# EAGLE design supply (EAGLE 6.1)
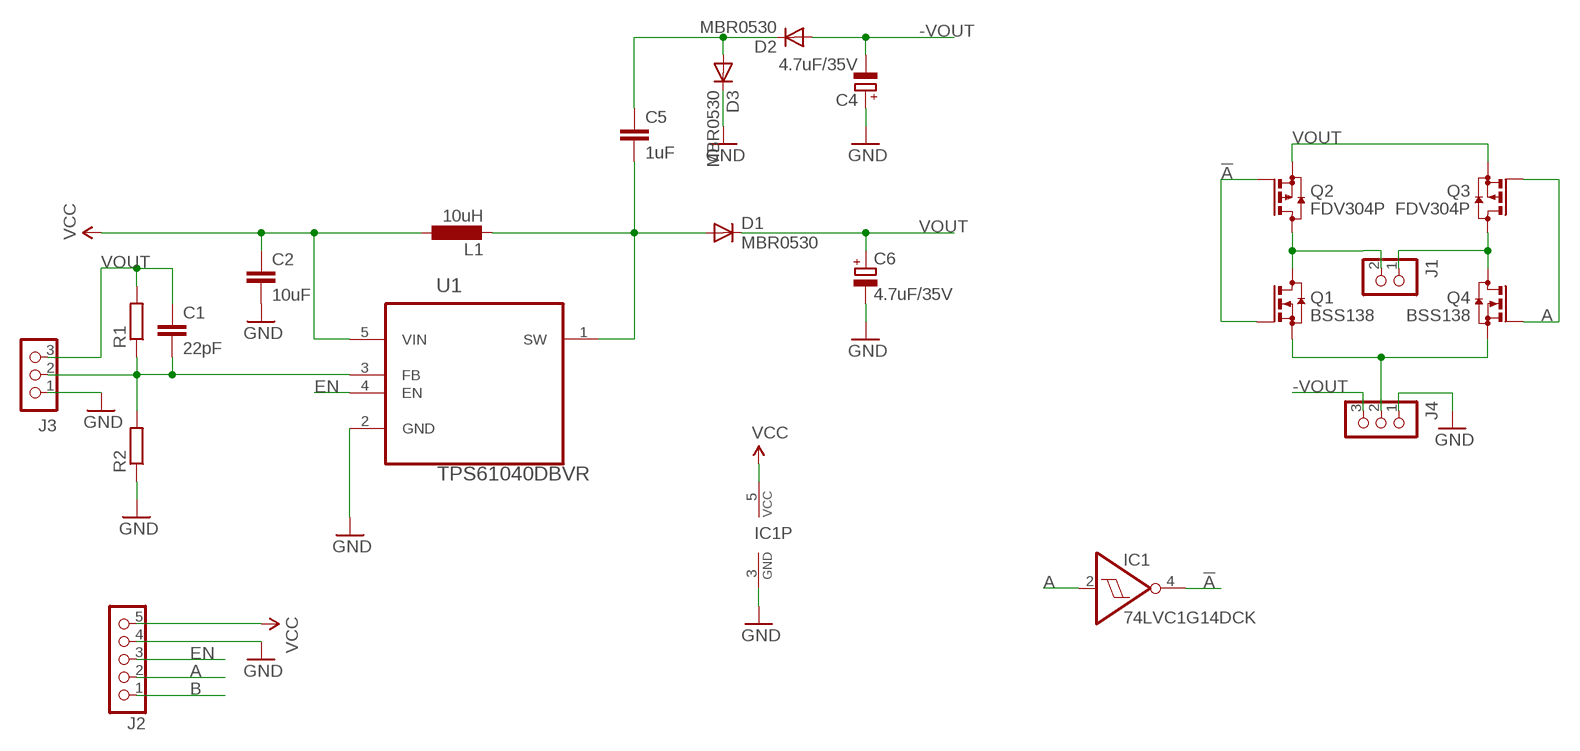
[diagram p0: schematic, sheet 1]

## Parts
C1  22pF  C-EUC0603  [C0603]
C2  10uF  C-EUC0603  [C0603]
C4  4.7uF/35V  CPOL-EU140CLH-1010  [140CLH-1010]
C5  1uF  C-EUC0603  [C0603]
C6  4.7uF/35V  CPOL-EU140CLH-1010  [140CLH-1010]
D1  MBR0530  DIODE-SOD123  [SOD123]
D2  MBR0530  DIODE-SOD123  [SOD123]
D3  MBR0530  DIODE-SOD123  [SOD123]
IC1  74LVC1G14DCK  [SC70-5]
J1  CON_HEADER_1X02-PTH  [M1X2]
J2  CON_HEADER_1X05-PTH  [M1X5]
J3  CON_HEADER_1X03-PTH  [M1X3]
J4  CON_HEADER_1X03-PTH  [M1X3]
L1  10uH  L-EUL2825P  [L2825P]
Q1  BSS138  BSS123  [SOT23]
Q2  FDV304P  BSS84  [SOT23]
Q3  FDV304P  BSS84  [SOT23]
Q4  BSS138  BSS123  [SOT23]
R1  R-EU_R0603  [R0603]
R2  R-EU_R0603  [R0603]
U1  TPS61040DBVR  [SOT95P280X145-5N]

## Nets
!A: IC1.4(O) Q1.1(G) Q2.1(G)
-VOUT: C4.- D2.A J4.3
A: IC1.2(I) J2.2 Q3.1(G) Q4.1(G)
B: J2.1
EN: J2.3 U1.4(EN)
GND: C2.2 C4.+ C6.- D3.C IC1.3(GND) J2.4 J3.1 J4.1 R2.1 U1.2(GND)
N$1: C1.2 J3.2 R1.1 R2.2 U1.3(FB)
N$2: C5.2 D1.A L1.2 U1.1(SW)
N$3: J1.2 Q1.3(D) Q2.3(D)
N$4: J1.1 Q3.3(D) Q4.3(D)
N$5: C5.1 D2.C D3.A
N$6: J4.2 Q1.2(S) Q4.2(S)
VCC: C2.1 IC1.5(VCC) J2.5 L1.1 U1.5(VIN)
VOUT: C1.1 C6.+ D1.C J3.3 Q2.2(S) Q3.2(S) R1.2

## Library data of the parts
C1 C2 C5 = rcl:C-EU: CAPACITOR, European symbol
C4 C6 = rcl:CPOL-EU: POLARIZED CAPACITOR, European symbol
D1-D3 = dan:DIODE-: DIODE
IC1 = 74xx-little-de:74*1G14: Single Schmitt-Trigger Inverter Gate
J1 = dp_devices:CON_HEADER_1X02
J2 = dp_devices:CON_HEADER_1X05
J3 J4 = dp_devices:CON_HEADER_1X03
L1 = rcl:L-EU: INDUCTOR, European symbol
Q1 Q4 = dan:BSS123: N-CHANNEL MOS FET
Q2 Q3 = transistor-small-signal:BSS84: P-CHANNEL MOS FET
R1 R2 = rcl:R-EU_: RESISTOR, European symbol
U1 = Texas Instruments_By_element14_Batch_1:TPS61040DBVR: LOW-POWER DC/DC BOOST CONVERTER; MPN: TPS61040DBVR; OC_FARNELL: 1461061; OC_NEWARK: 35K1326; PACKAGE: SOT-23-5; SUPPLIER: Texas Instruments

## Board
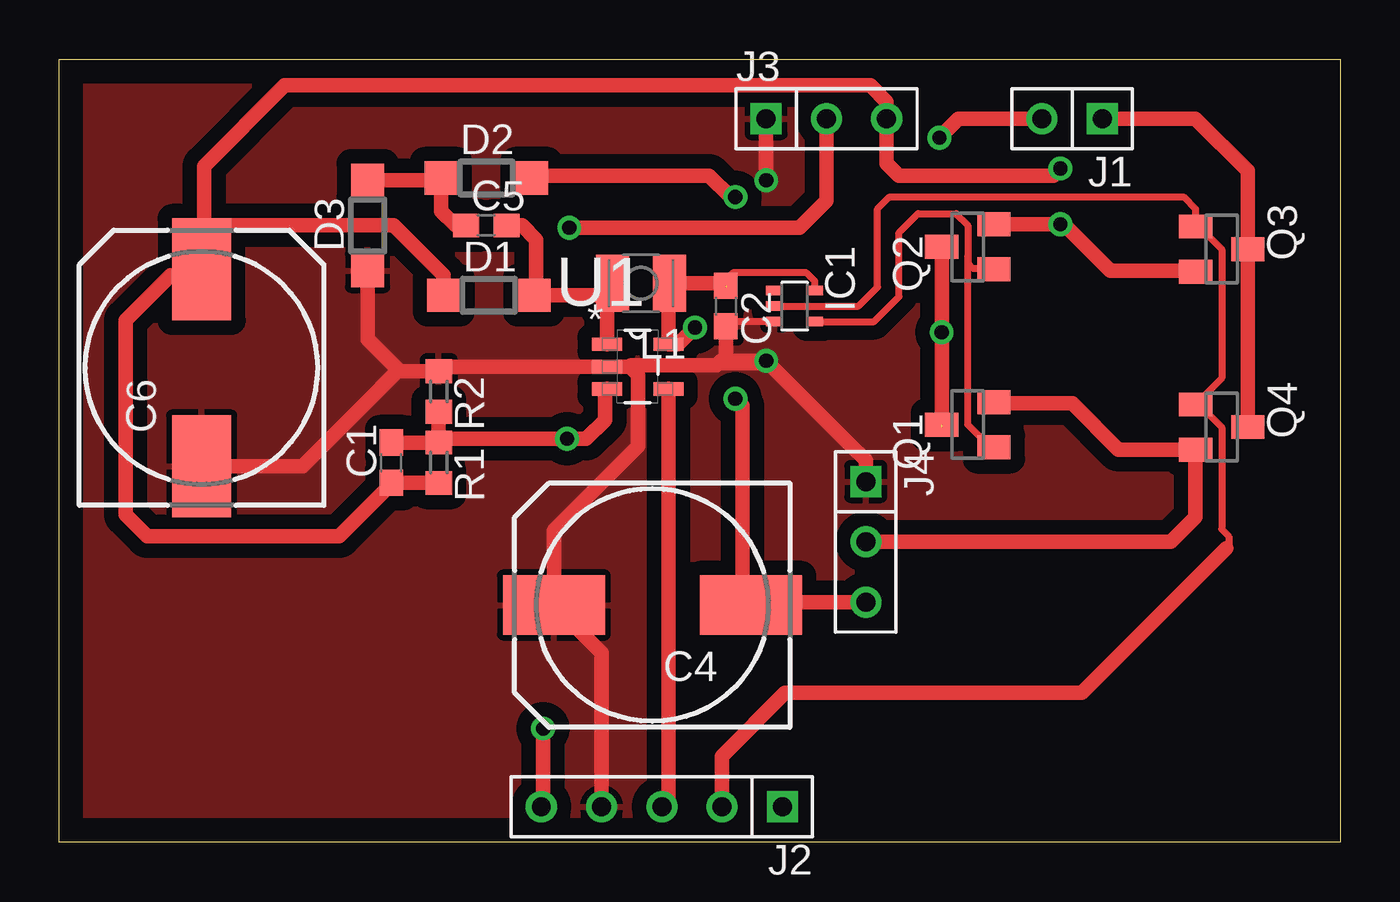
[diagram p1: board, top side]
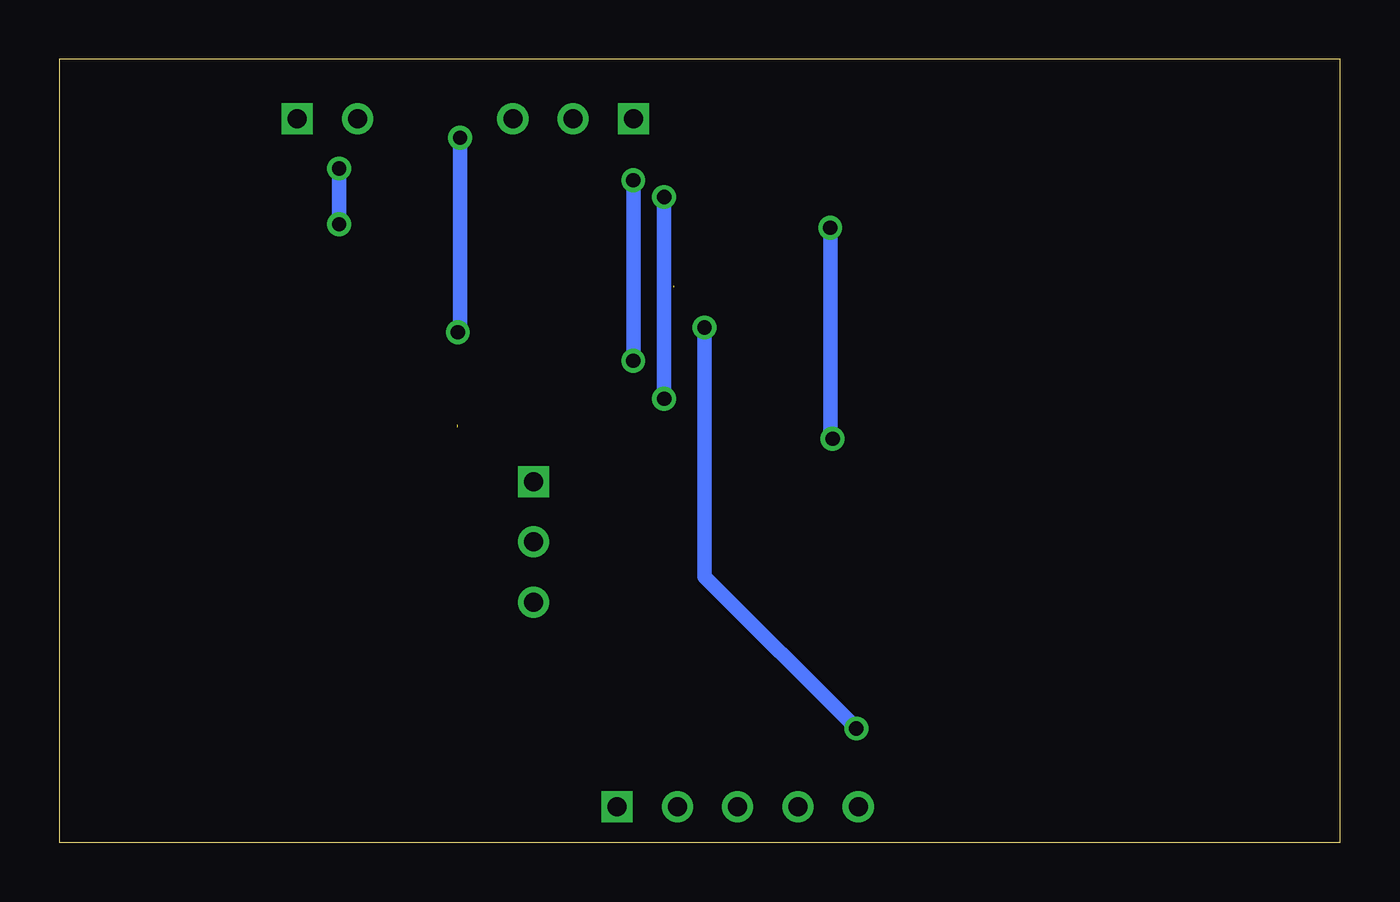
[diagram p2: board, bottom side, seen from below]

Size 54 x 33 mm. Coordinates in mm from the lower left corner, seen from the top.
Outline: 0,0 0,33 54,33 54,0 0,0
Copper layers (1*16): Top 0.035mm / dielectric 1.5mm / Bottom 0.035mm
Design rules: minimum track width 10mil, minimum drill 24mil, track to track 8mil, track to pad 8mil, pad to pad 8mil, via to via 8mil, smd to smd 8mil, copper to edge 40mil, drill to drill 8mil, minimum pad ring 10mil, minimum via ring 8mil, stop-mask expansion 4mil, vias tented up to drill 0mil, thermal gap 10mil

### Footprints (pad centres in the part's own frame; a part is rotated, then mirrored left to right if it is on the bottom)
C0603 = smd 1.1 x 1: 1 -0.85,0; 2 0.85,0
140CLH-1010 = smd 4.3 x 2.5: + 4.15,0; - -4.15,0
SOD123 = smd 1.4 x 1.4: A 1.9,0; C -1.9,0
SC70-5 = smd 0.4 x 0.7: 1 -0.65,-0.85; 2 0,-0.85; 3 0.65,-0.85; 4 0.65,0.85; 5 -0.65,0.85
M1X2 = drill 0.8 square: 1 -1.27,0 | drill 0.8: 2 1.27,0
M1X5 = drill 0.8 square: 1 -5.08,0 | drill 0.8: 2 -2.54,0; 3 0,0; 4 2.54,0; 5 5.08,0
M1X3 = drill 0.8 square: 1 0,0 | drill 0.8: 2 2.54,0; 3 5.08,0
L2825P = smd 1.4 x 2.4: 1 -1.2,0; 2 1.2,0
SOT23 = smd 1 x 1.4: 1 -0.95,-1.1; 2 0.95,-1.1; 3 0,1.1
R0603 = smd 1 x 1.1: 1 -0.85,0; 2 0.85,0
SOT95P280X145-5N = smd 1.27 x 0.559: 1 -1.295,0.94; 2 -1.295,0; 3 -1.295,-0.94; 4 1.295,-0.94; 5 1.295,0.94

### Placement (x,y rotation side)
C1  14,16 90 top
C2  28.1,22.6 270 top
C4  25,10 180 top
C5  18,26 0 top
C6  6,20 90 top
D1  18.11,23.06 0 top
D2  18,28 0 top
D3  13,26 90 top
IC1  31,22.6 270 top
J1  42.7,30.5 180 top
J2  25.4,1.5 180 top
J3  29.8,30.5 0 top
J4  34,15.2 270 top
L1  24.52,23.56 180 top
Q1  38.3,17.6 90 top
Q2  38.3,25.1 90 top
Q3  49,25 270 top
Q4  49,17.5 270 top
R1  16,16 270 top
R2  16,19 270 top
U1  24.38,20.05 0 top

### Tracks (layer width: path | path; a pad name or v marks a point on that pad's centre or on a via)
!A
  Top 0.305: IC1.4 34.35,21.95 35.4,23 35.4,25.7 36.2,26.5 37.8,26.5 38.3,26 38.3,24.7 | 38.3,24.7 38.3,24.4 38.5,24.2 39.35,24.2 Q2.1 | Q1.1 39.25,16.65 38.3,17.6 38.3,24.7
-VOUT  (via drill 0.6)
  Top 0.61: 28.5,10 C4.- 29.48,10 29.6,10.12 | J4.3 29.6,10.12 | 29.6,10.12 28.88,10.12 28.8,10.2 28.8,18.4 v28.5,18.7 | v28.5,27.2 28.3,27.2 27.4,28.1 20,28.1 D2.A
  Bottom 0.61: v28.5,18.7 v28.5,27.2
A
  Top 0.305: IC1.2 33.7,22.6 34.5,23.4 34.5,26.7 35,27.2 47.4,27.2 47.9,26.7 Q3.1 48.05,25.95 49,25 49,19.55 Q4.1 48.05,18.45 49,17.5 49,13.2 49.3,12.9 49.3,12.5 49.2,12.4
  Top 0.61: J2.2 27.94,3.64 30.6,6.3 43.1,6.3 49.2,12.4
EN
  Top 0.61: U1.4 25.68,1.77 J2.3
GND  (via drill 0.6)
  Top 0.305: IC1.3 28.3,21.95 C2.2
  Top 0.61: C6.- 10.25,15.85 12.85,18.45 | 12.85,18.45 13,18.6 | 14.25,19.85 R2.1 16.2,20.05 U1.2 24.05,20.05 | 14.25,19.85 12.85,18.45 | D3.C 13,21.2 14.25,19.95 | 14.25,19.95 14.3,19.9 | 24.05,20.05 24.1,20 24.4,19.7 24.4,17 24.4,16.7 20.85,13.15 C4.+ 22.86,7.99 J2.4 | 14.25,19.85 14.25,19.95 | J4.1 34,16.1 33.3,16.8 v29.8,20.3 | 24.05,20.05 24.1,20.1 27.7,20.1 27.9,20.3 v29.8,20.3 | J3.1 v29.8,27.9 | C2.2 28.1,20.4 27.9,20.2 29.7,20.2 v29.8,20.3
  Bottom 0.61: v29.8,27.9 v29.8,20.3
  pour Top (isolate 0.61): 0,33 53,33 53,0 0,0
N$1  (via drill 0.6)
  Top 0.61: 16,17.01 R1.1 | R1.1 16,17.01 | 16,17.01 R2.2 | R1.1 C1.2 | 16,17.01 v21.4,17.01 | v21.4,17.01 21.9,17.01 | 21.9,17.01 22.21,17.01 23,17.8 23,19 23,19.03 U1.3 | J3.2 32.34,27.04 31.2,25.9 v21.5,25.9 | v21.4,17.01 21.9,17.01
  Bottom 0.61: v21.5,25.9 21.5,17.11 v21.4,17.01
N$2
  Top 0.61: C5.2 19.5,26 20.1,25.4 20.1,23.15 D1.A 22.82,23.06 L1.2 23.09,23.32 U1.1
N$3  (via drill 0.6)  (1 unrouted)
  Top 0.61: Q2.3 37.2,21.6 | 37.2,21.6 v37.2,21.5 | v37.2,21.5 37.2,17.5 | J1.2 37.9,30.5 v37.1,29.7 | v37.2,21.5 37.2,21.6
  Bottom 0.61: v37.1,29.7 37.1,21.6 v37.2,21.5
N$4
  Top 0.61: Q4.3 Q3.3 50.1,28.3 47.9,30.5 J1.1
N$5
  Top 0.61: D3.A 16,27.9 D2.C 16.1,26.6 16.7,26 C5.1
N$6
  Top 0.61: Q1.2 39.45,18.5 42.7,18.5 44.65,16.55 Q4.2 47.9,13.7 46.86,12.66 J4.2
VCC  (via drill 0.6)  (1 unrouted)
  Top 0.305: IC1.5 31.85,23.65 31.5,24 28.4,24 28.1,23.7 28.1,23.4
  Top 0.61: C2.1 27.99,23.56 L1.1 25.68,23.51 U1.5 26.09,20.99 v26.8,21.7 | v20.4,4.8 20.4,1.58 J2.5
  Bottom 0.61: v26.8,21.7 26.8,11.2 v20.4,4.8
VOUT  (via drill 0.6)
  Top 0.61: C1.1 R1.2 14.05,15.15 11.8,12.9 3.7,12.9 2.8,13.8 2.8,22 4.7,23.9 5.75,23.9 C6.+ | D1.C 16.21,23.89 14.1,26 6.7,26 5.8,25.1 5.8,24.35 C6.+ | Q2.2 41.7,26.05 | 41.7,26.05 v42.2,26.05 | v42.2,26.05 42.35,26.05 44.3,24.1 47.85,24.1 Q3.2 | J3.3 34.88,28.62 | 34.88,28.62 35.4,28.1 41.9,28.1 v42.2,28.4 | v42.2,26.05 41.7,26.05 | 34.88,28.62 34.88,31.22 34.2,31.9 9.5,31.9 6.1,28.5 6.1,24.25 C6.+
  Bottom 0.61: v42.2,28.4 v42.2,26.05